# Altium schematic sheet PWM_soldeerbout.SchDoc
size A4; Address1: PXL EAI 1001; Revision: V 1.0; SheetNumber: 4; SheetTotal: 4
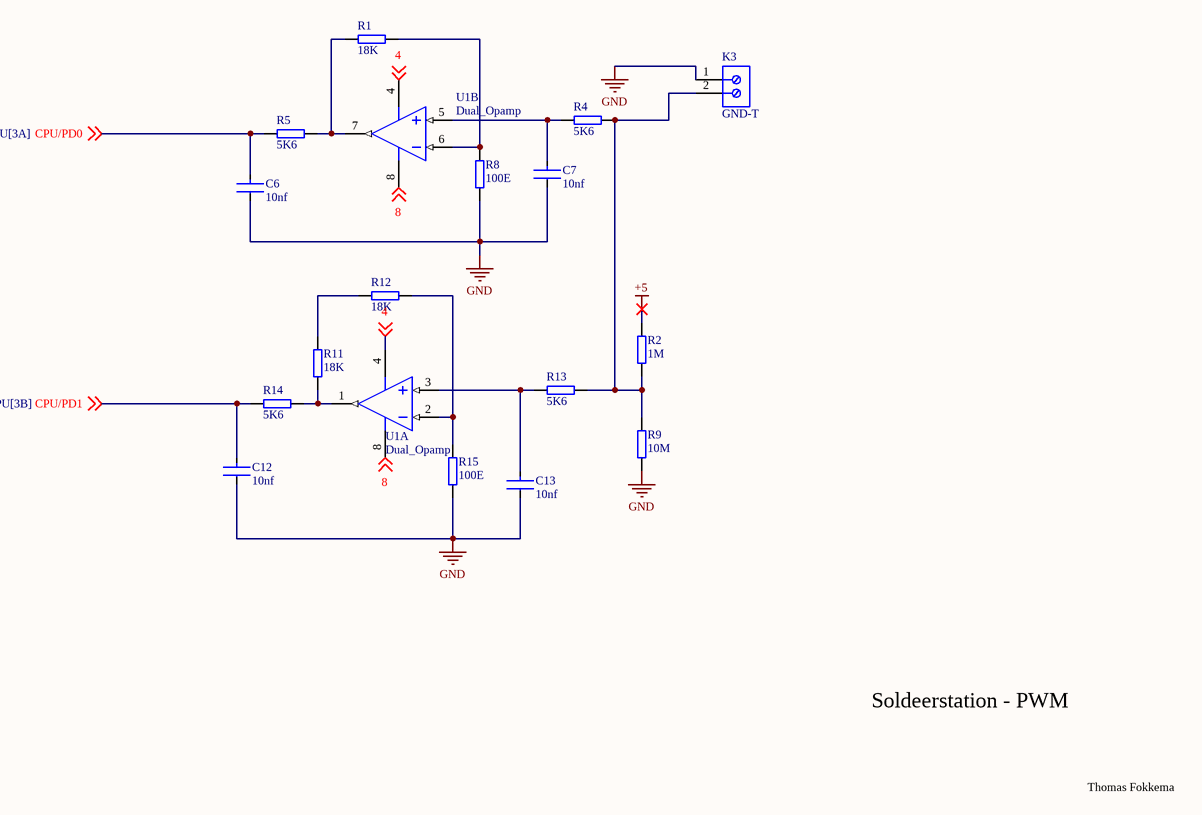
[diagram p0: PWM_soldeerbout.SchDoc]

## Parts
C6  10nf  [CC_0805_L]
C7  10nf  [CC_0805_L]
C12  10nf  [CC_0805_L]
C13  10nf  [CC_0805_L]
K3  GND-T  [PHOE-1714955_V]
R1  18K  [R_0805_M]
R2  1M  [R_0805_M]
R4  5K6  [R_0805_M]
R5  5K6  [R_0805_M]
R8  100E  [R_0805_M]
R9  10M  [R_0805_M]
R11  18K  [R_0805_M]
R12  18K  [R_0805_M]
R13  5K6  [R_0805_M]
R14  5K6  [R_0805_M]
R15  100E  [R_0805_M]
U1  Dual_Opamp  [MSOP_8_M]  (parts A,B of 2)

## Nets
+5: R2.2
GND: C6.2 C7.2 C12.2 C13.2 K3.1 R8.1 R9.1 R15.1
4: U1.4(VSS) ; off-sheet 4
8: U1.8(VDD) ; off-sheet 8
CPU/PD0: C6.1 R5.1 ; off-sheet CPU/PD0
CPU/PD1: C12.1 R14.1 ; off-sheet CPU/PD1
NetC7_1: C7.1 R4.1 U1.5(VINB+)
NetC13_1: C13.1 R13.1 U1.3(VINA+)
NetK3_2: K3.2 R2.1 R4.2 R9.2 R13.2
NetR1_1: R1.1 R5.2 U1.7(VOUTB)
NetR1_2: R1.2 R8.2 U1.6(VINB-)
NetR11_1: R11.1 R14.2 U1.1(VOUTA)
NetR11_2: R11.2 R12.1
NetR12_2: R12.2 R15.2 U1.2(VINA-)

## Notes on the sheet
- Soldeerstation - PWM
- Thomas Fokkema

## Library data of the parts
C6 C7 C12 C13 = Capacitor_Ceramic: Manufacturer: KEMET; Manufacturer Part Number: C0805C224K5RACTU; Value: 0.22 μF; Temperature Characteristic: X7R; Temperature Coefficient: 30ppm/°C; Tolerance: 0.1; Voltage Rating: 50 V; ComponentLink2URL: https://content.kemet.com/datasheets/KEM_C1003_C0G_SMD.pdf; Device Class L3: Ceramic Capacitors; Lead Free: Yes; Temperature: -55°C to +125°C; RoHS: TRUE; Capacitance: 0.22 μF; Automotive: No; Material: Ceramic; Octopart: https://octopart.com/c0805c224k5ractu-kemet-144670; Temperature Range Low: -55°C; Height: 0.88mm; Device Class L1: Passive Components; Digikey Description: CAP CER 0.22UF 50V X7R 0805; ComponentLink2Description: Datasheet; Mouser Description: CAP CER 0.22UF 50V X7R 0805; Category: Cap; Ipc Land Pattern Name: CAPC200125X78; Temperature Range High: +125°C; Package: C0805C-DN; Device Class L2: Capacitors
K3 = CMP-2000-05797-1: PC Terminal Block, Pitch 6.35 mm, 1 x 2 Position, Height 21.5 mm, Tail Lenght 5.1 mm, RoHS, Bulk; Manufacturer: Phoenix Contact; Package Description: PC Terminal Block, Pitch 6.35 mm, 1 x 2 Position, Height 21.5 mm, Tail Lenght 5.1 mm; Datasheet URL: http://media.digikey.com/pdf/Data%20Sheets/Phoenix%20Contact%20PDFs/1714955.pdf; Package Reference: 1714955; Manufacturer URL: http://www.phoenixcontact.com/; Datasheet Version: 02/2010; Mounting Technology: ThroughHole
R1 R2 R4 R5 R8 R9 R11-R15 = Resistor: Manufacturer: Vishay Dale; Part Number: CRCW08050000Z0EA
U1 = Dual_Opamp: Slew Rate: 0.6V/µs; Supply Current: 100uA; Power Supply Rejection Ratio (PSRR): 86dB; Input Offset Voltage (Vos): 4.5mV; Input Bias Current: 1pA; Amplifier Type: GENERAL PURPOSE; Unity Gain Bandwidth Product: 1MHz; Number of Circuits: 2; Output Current: 23mA; Operating Supply Voltage: 5.5V; Min Supply Voltage: 1.8V; Common Mode Rejection Ratio: 60dB; Voltage Gain: 112dB; Max Supply Voltage: 6V; Package Quantity: 60; REACH SVHC: No SVHC; Min Operating Temperature: -40°C; Max Operating Temperature: 125°C; Mount: Through Hole; Nominal Supply Current: 100uA; Height: 3.3mm; Length: 9.27mm; Slew Rate-Nom: 0.6V/µs; Packaging: Rail/Tube; Output Current per Channel: 23mA; Number of Amplifiers: 2; RoHS Compliant: Yes; Radiation Hardening: No; Bandwidth: 1MHz; Lead Free: Lead Free; Width: 6.35mm; Number of Channels: 2; Gain Bandwidth Product: 1MHz; Technology: CMOS; Operating Supply Current: 100uA; Number of Elements: 2; Number of Pins: 8; Input Offset Voltage-Max: 4.5mV; Case/Package: PDIP